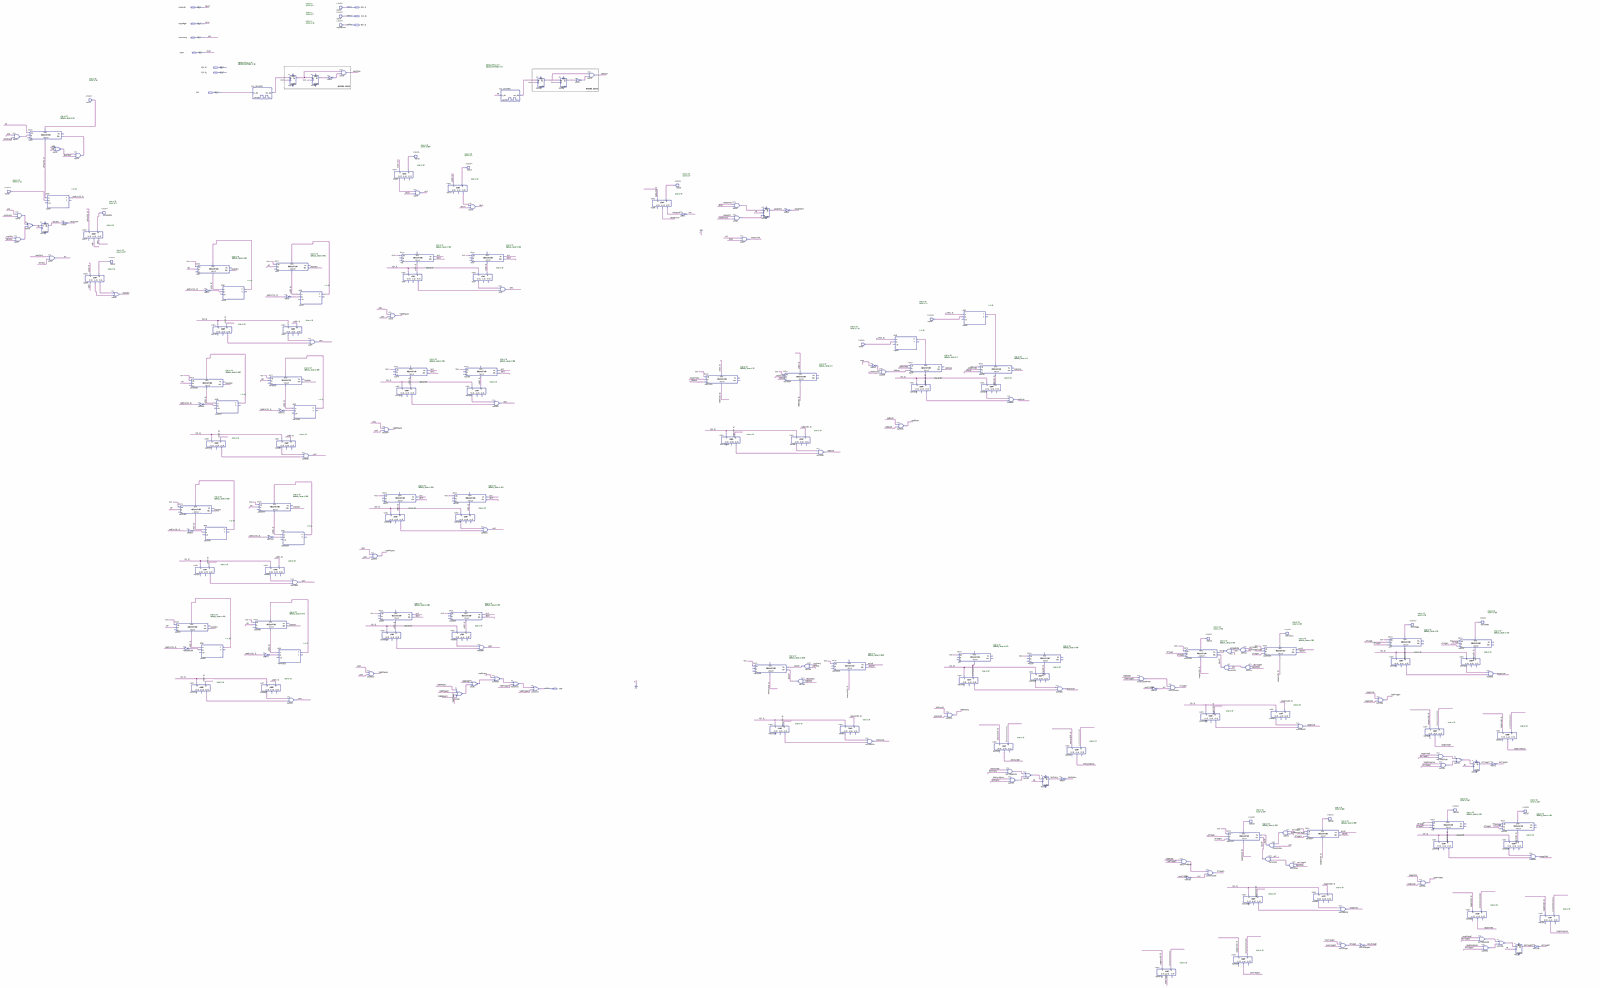
[diagram p0: schematic sheet, whole]
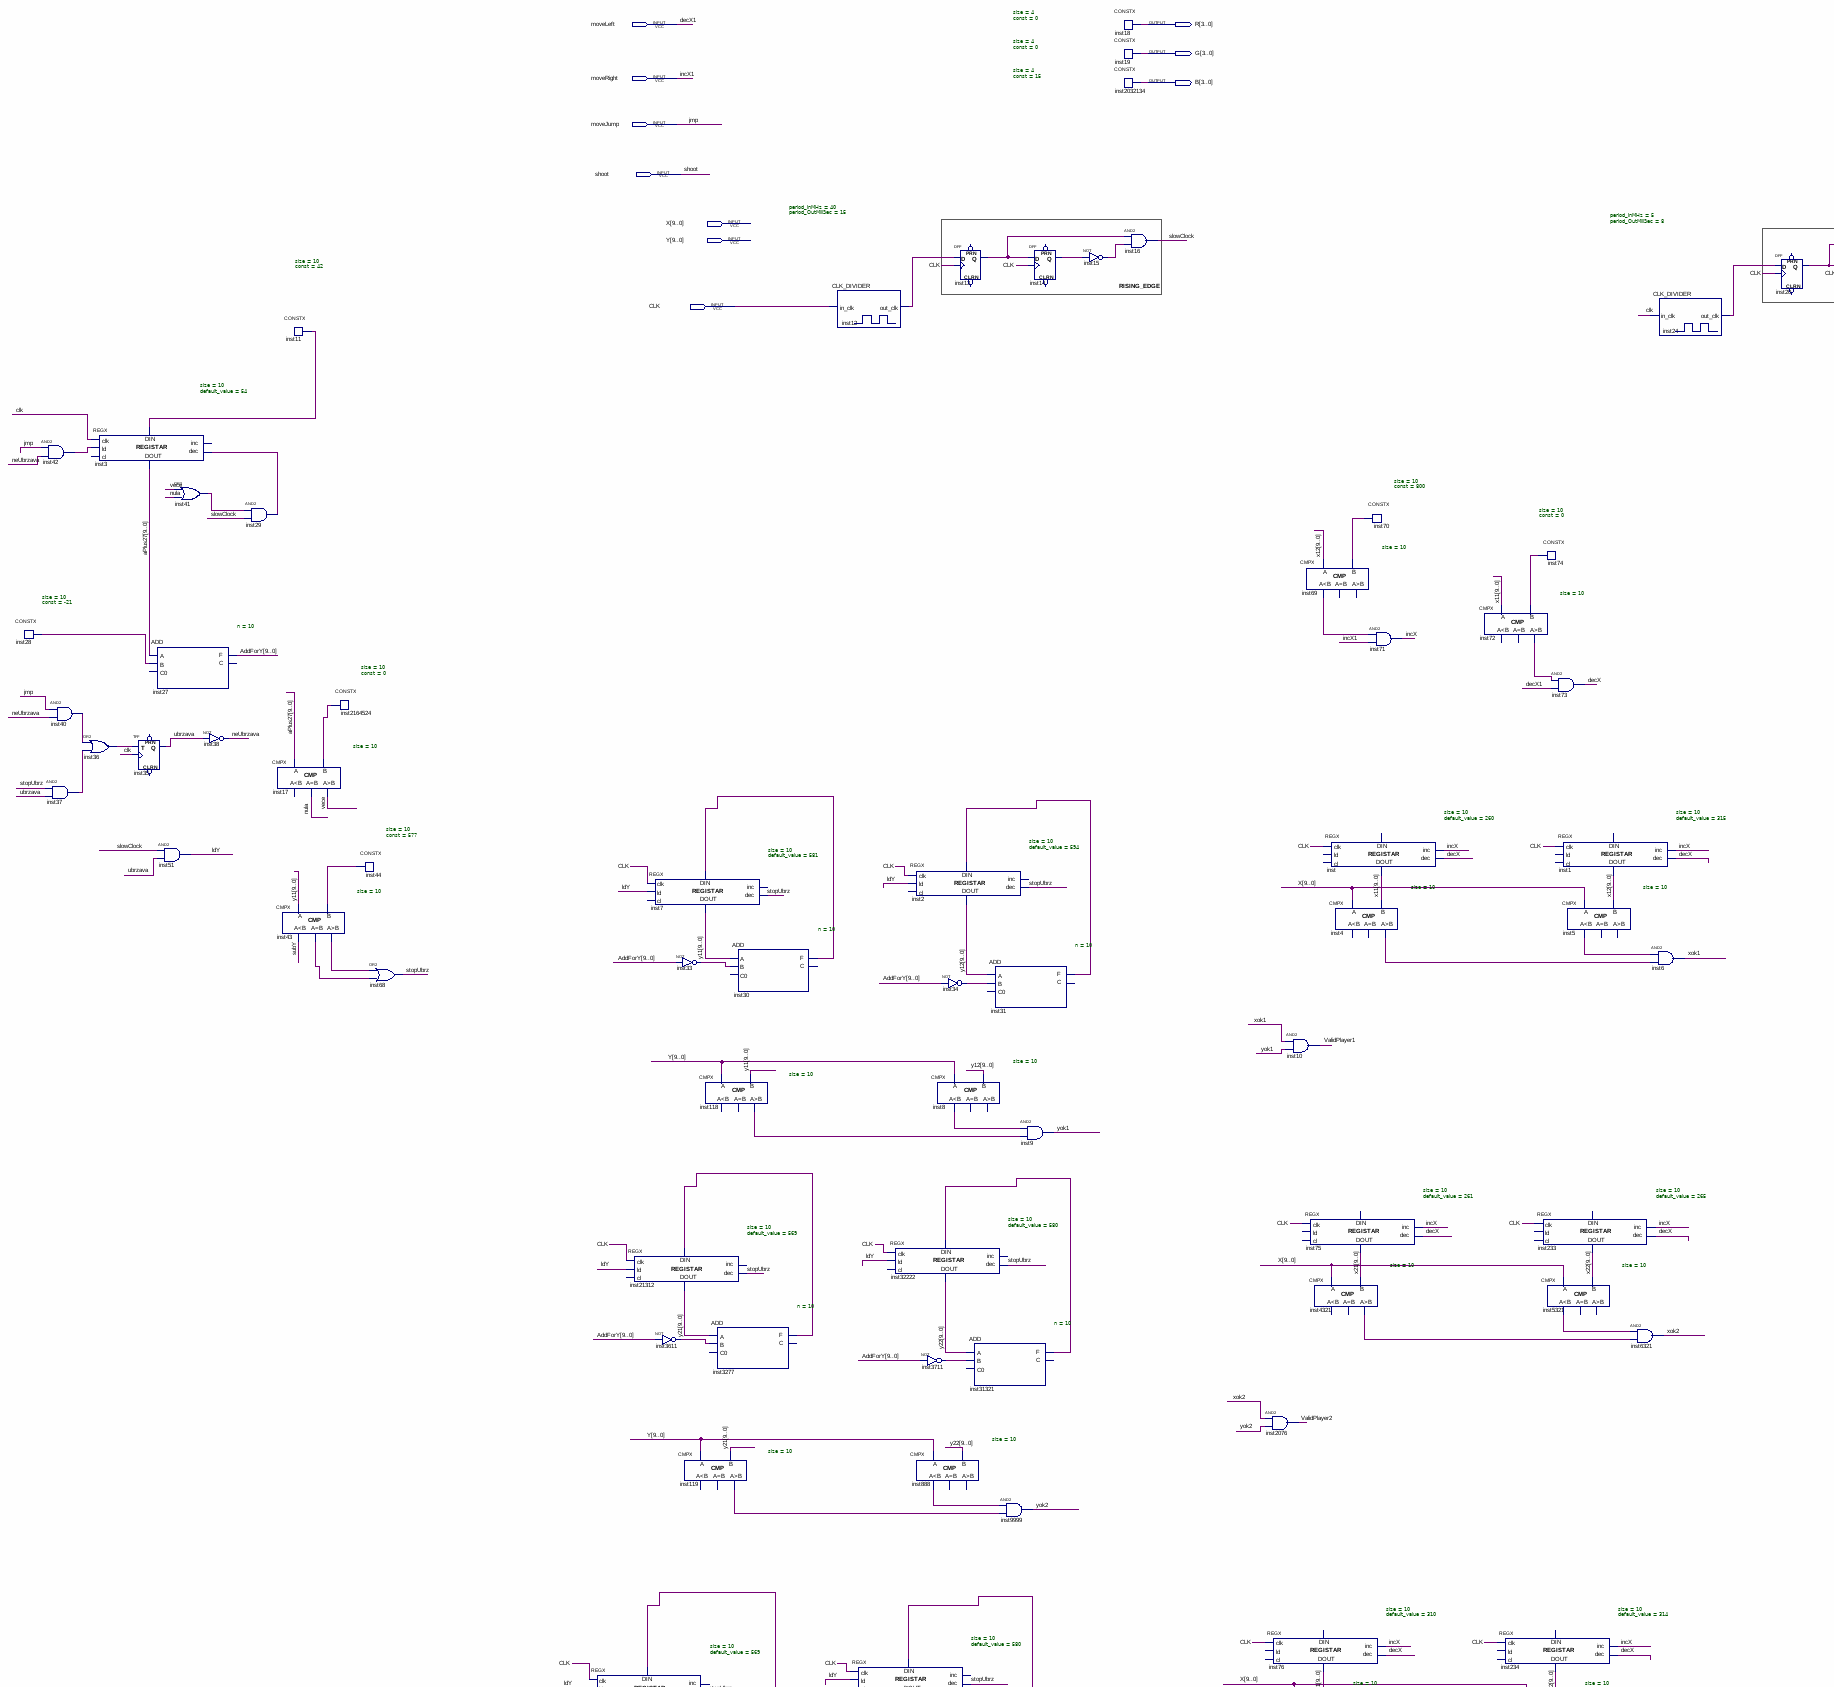
[diagram p1: schematic sheet, upper left part]
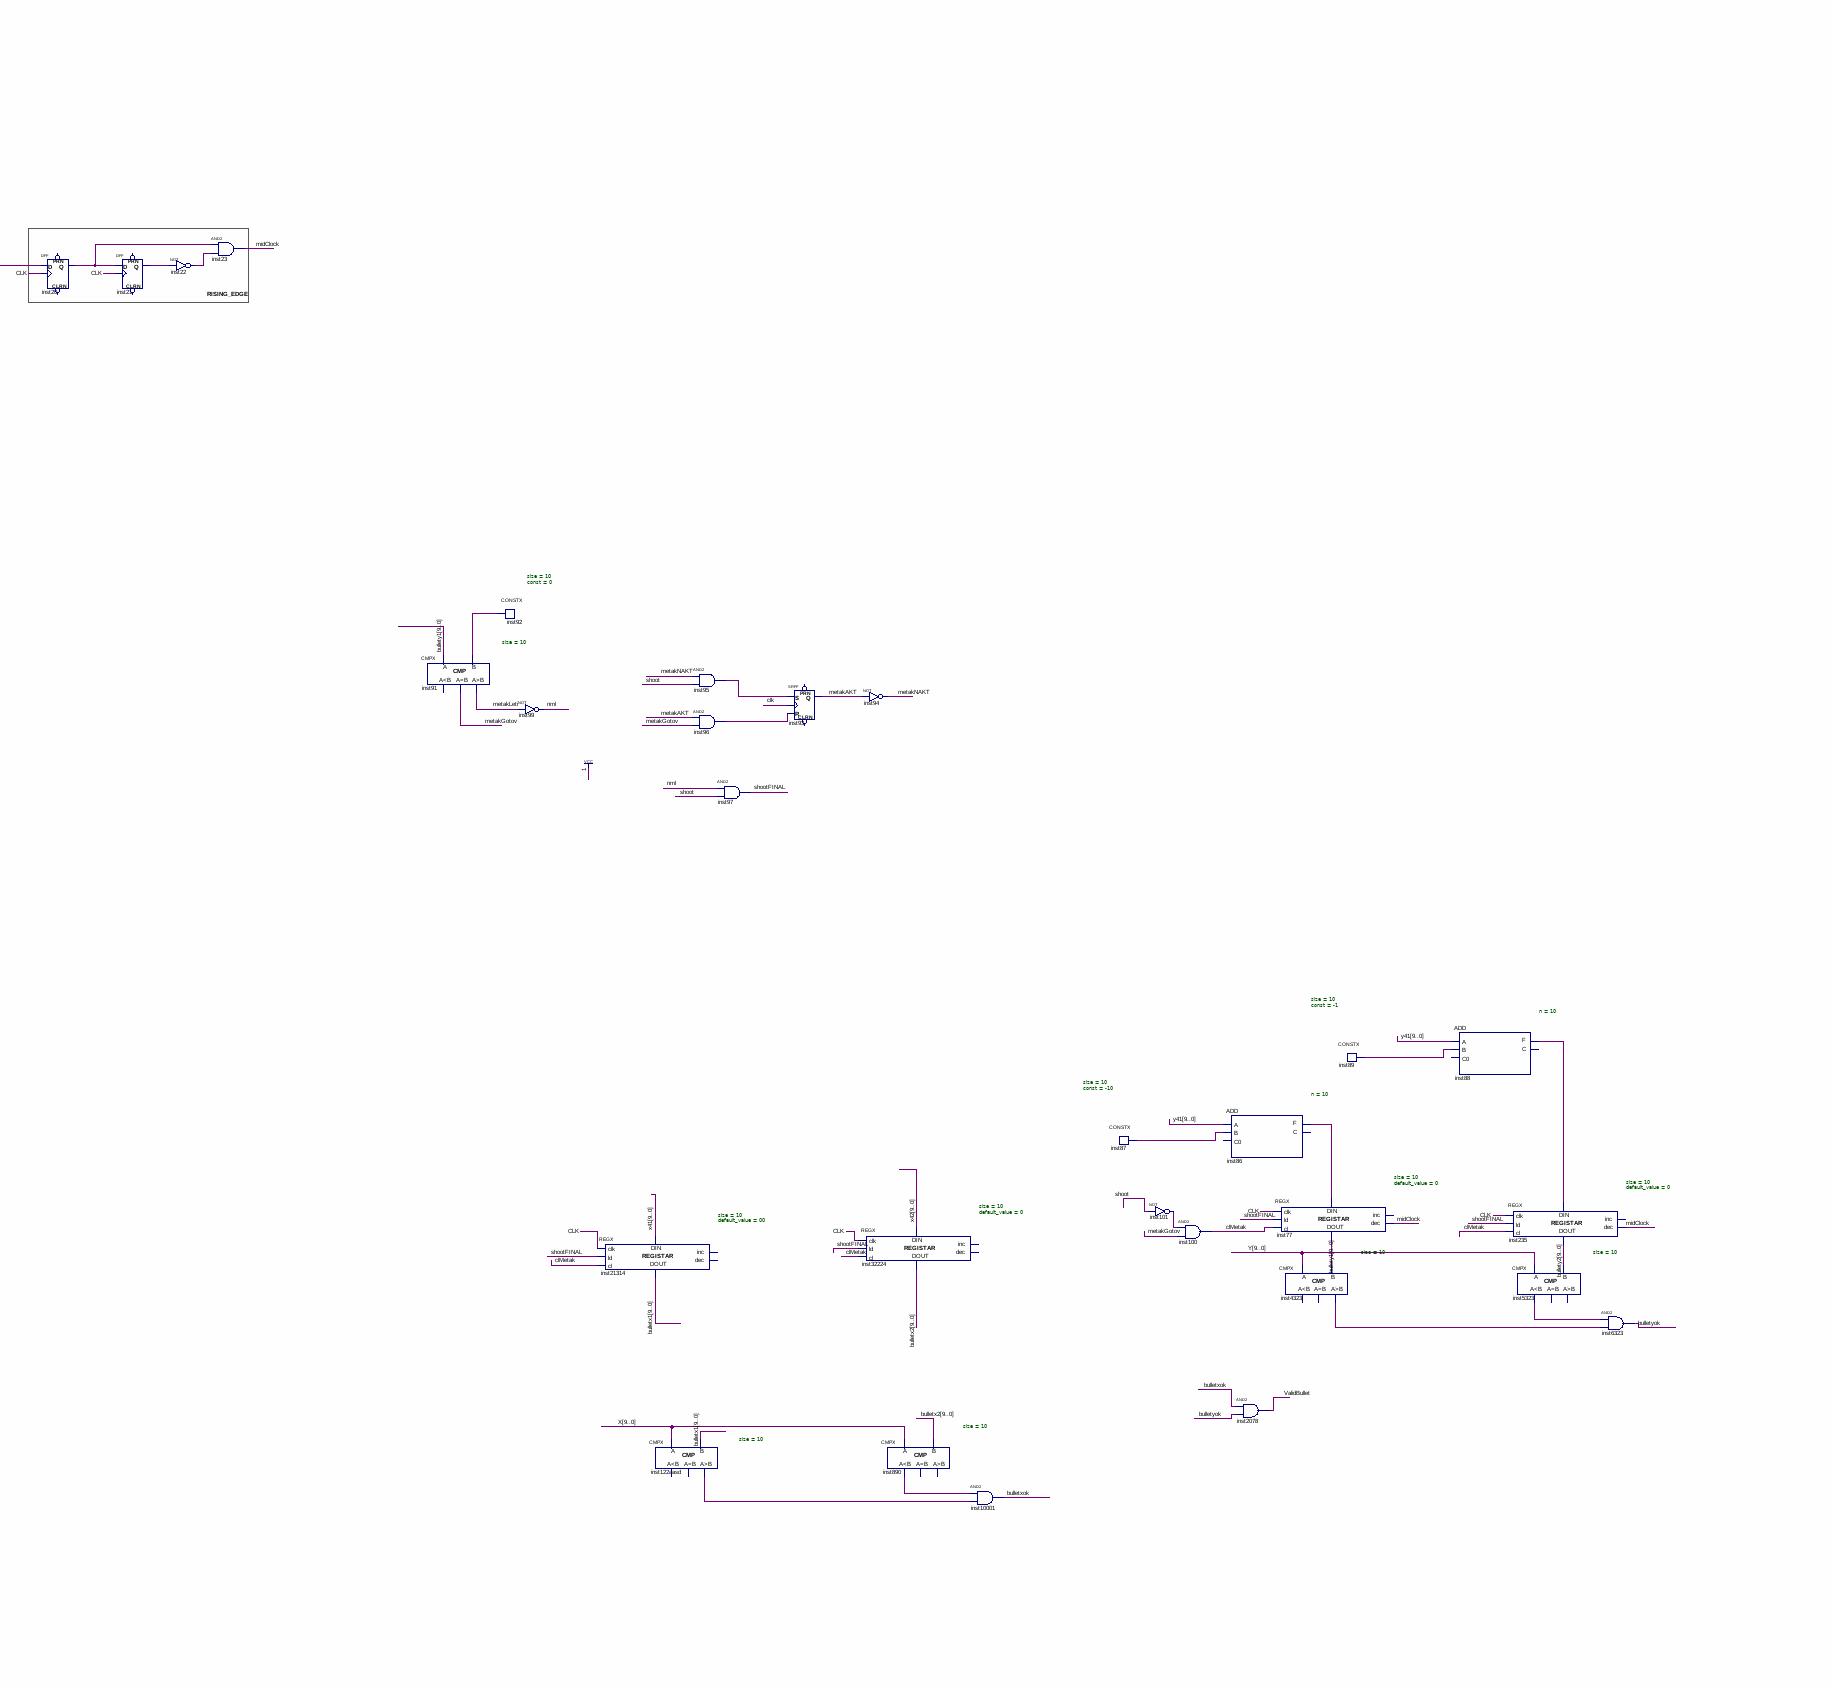
[diagram p2: schematic sheet, upper centre part]
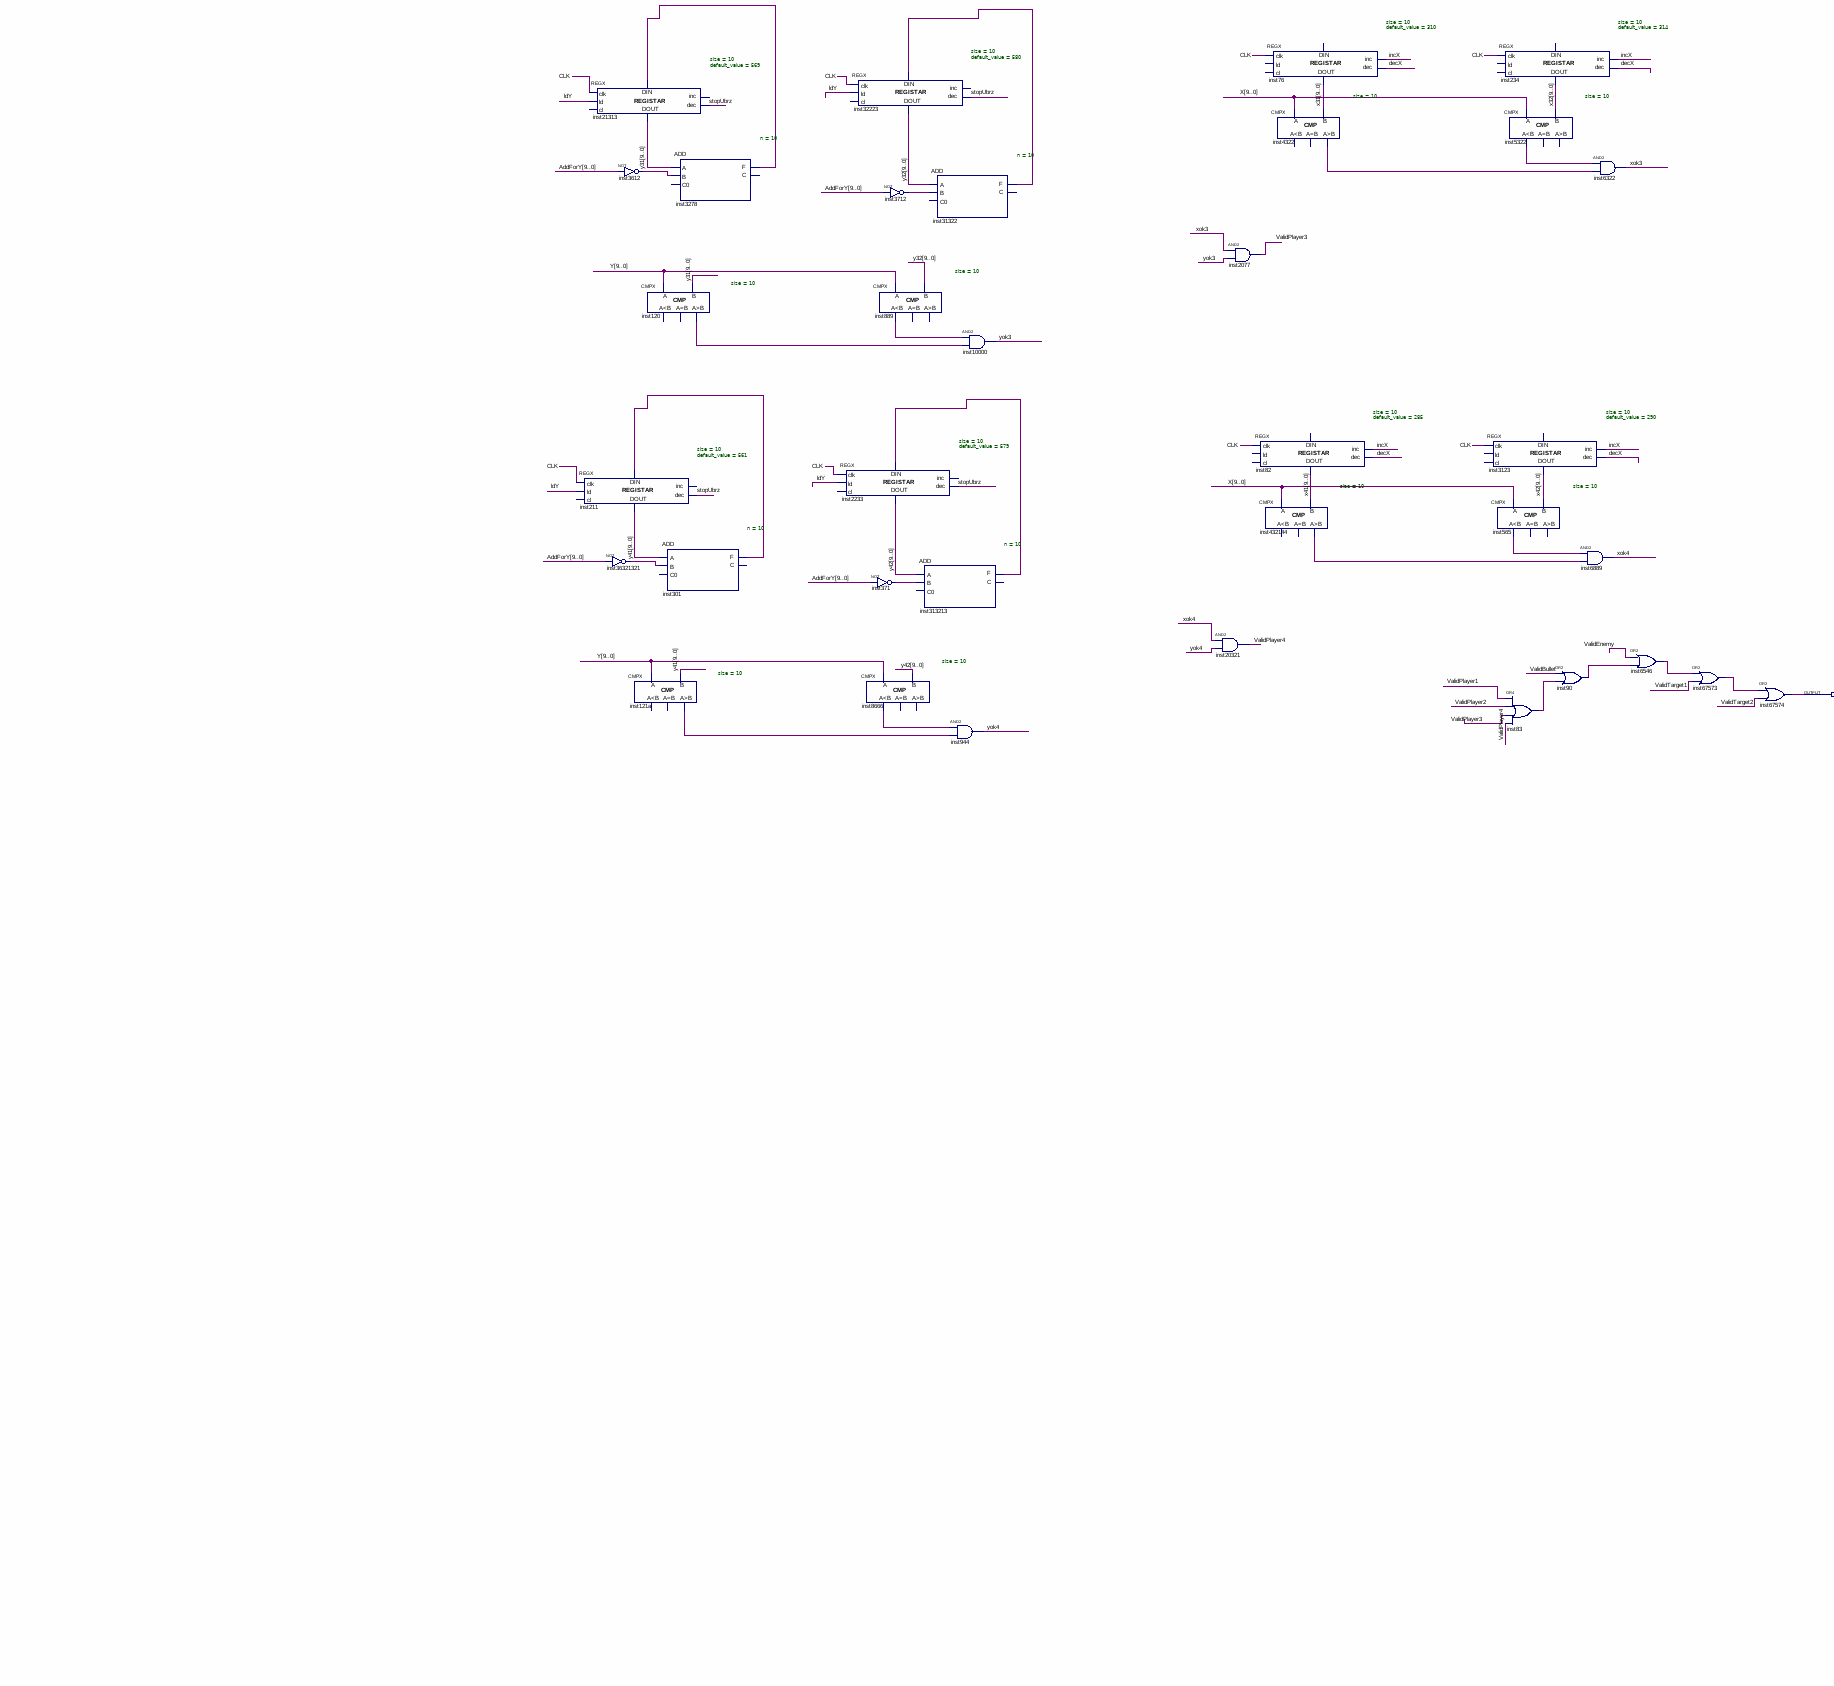
[diagram p3: schematic sheet, lower left part]
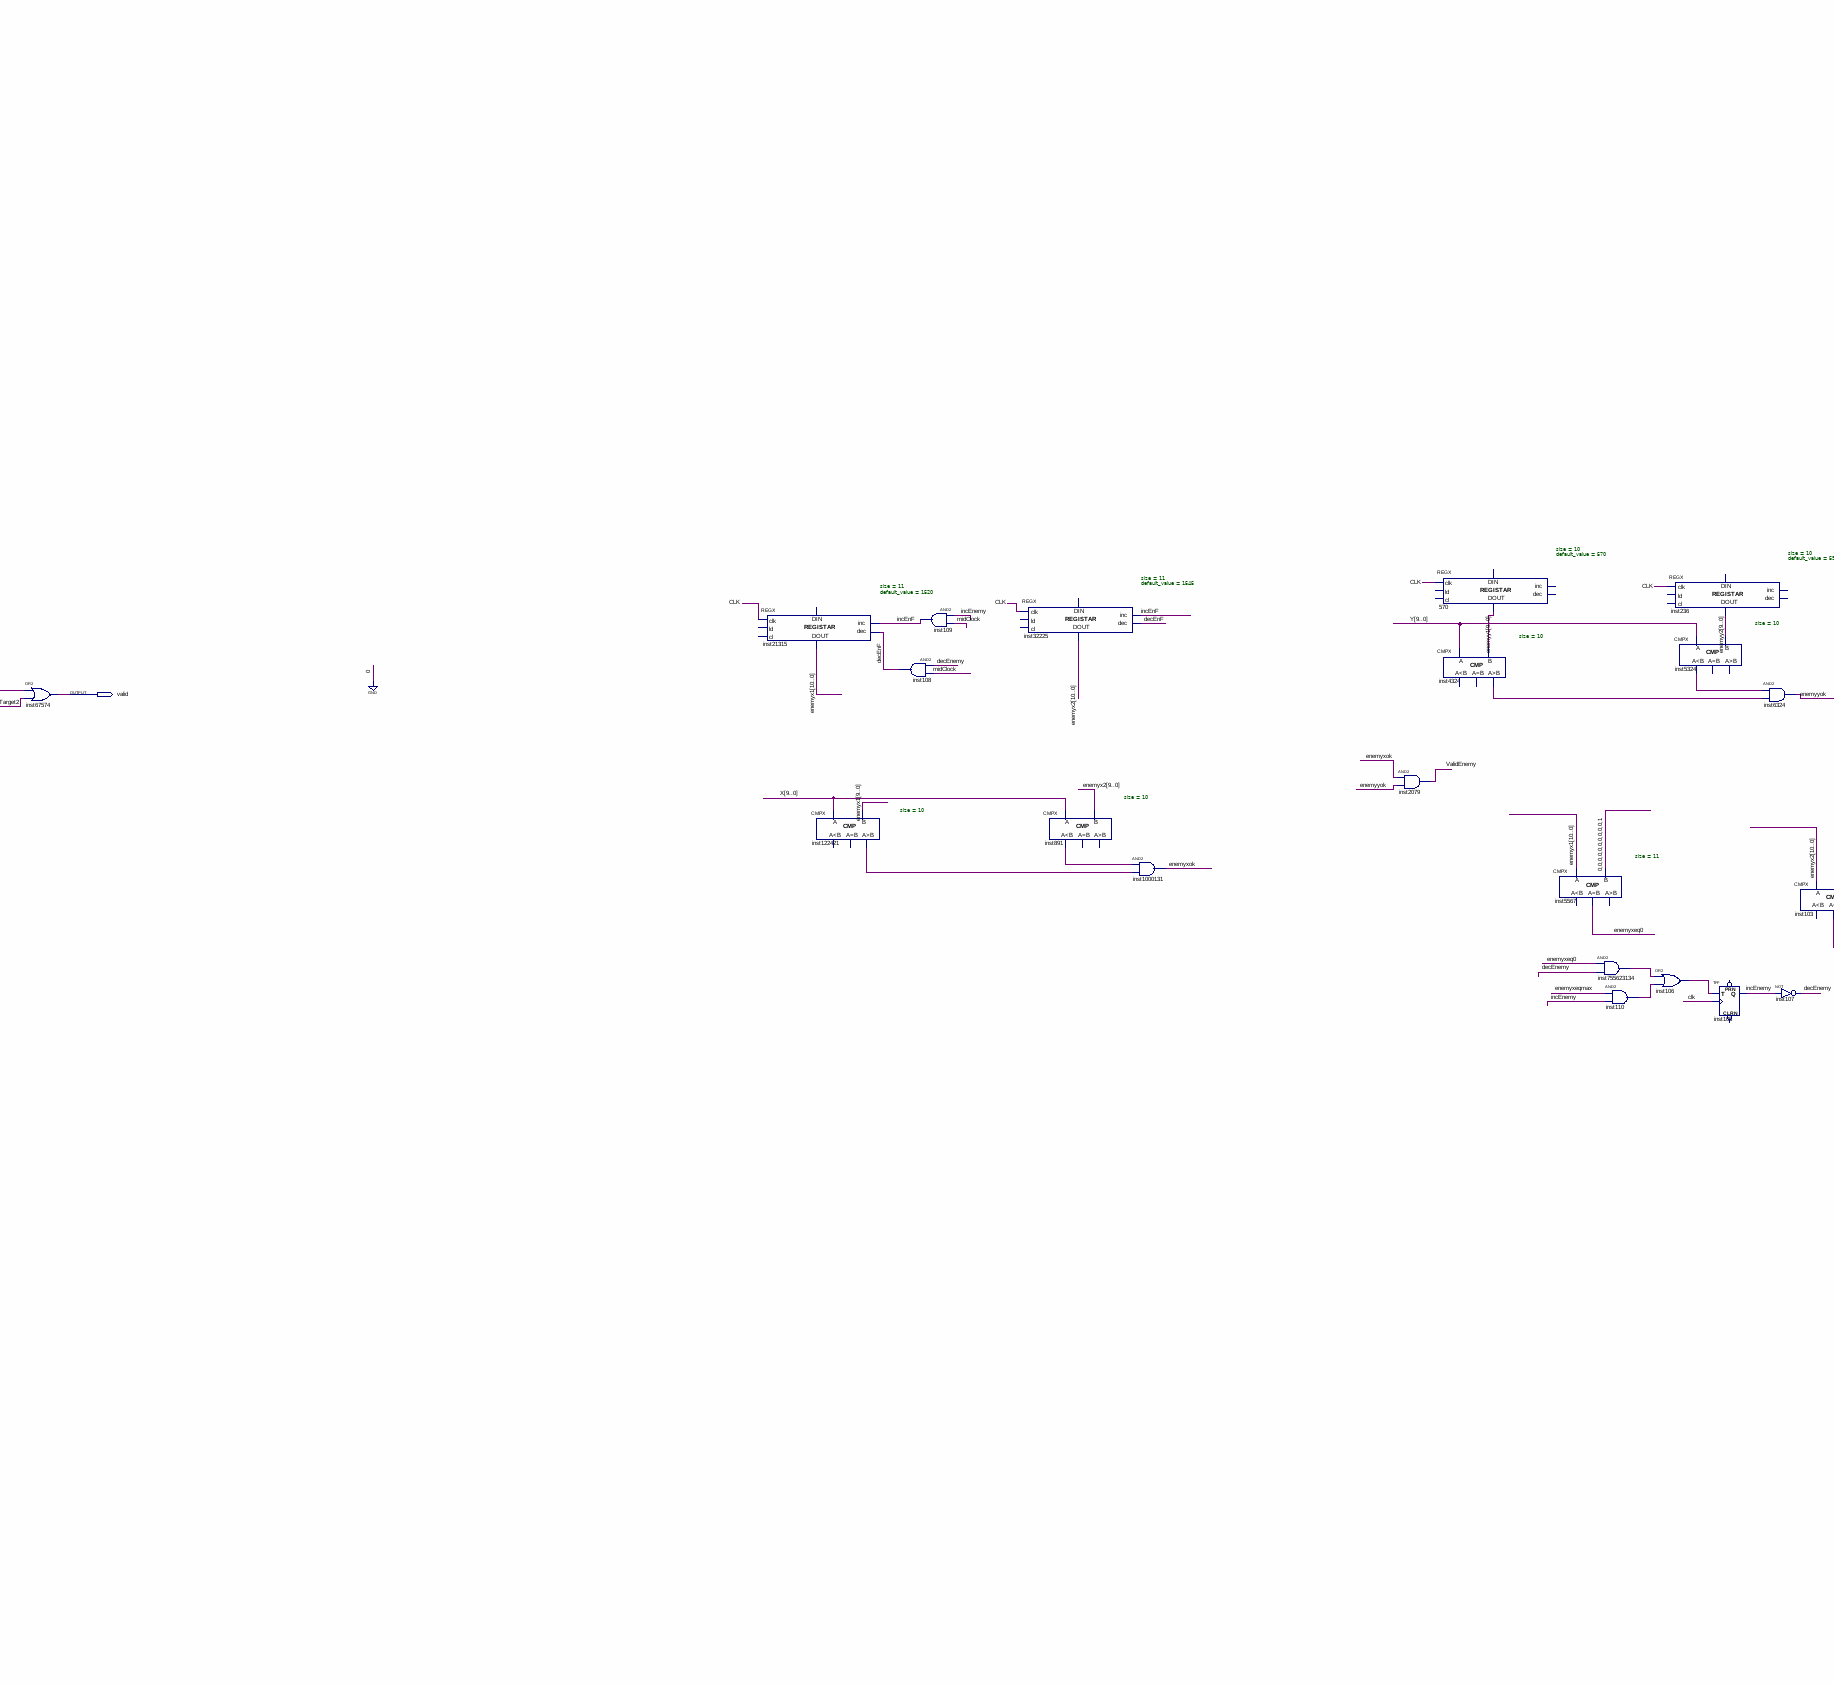
[diagram p4: schematic sheet, lower centre part]
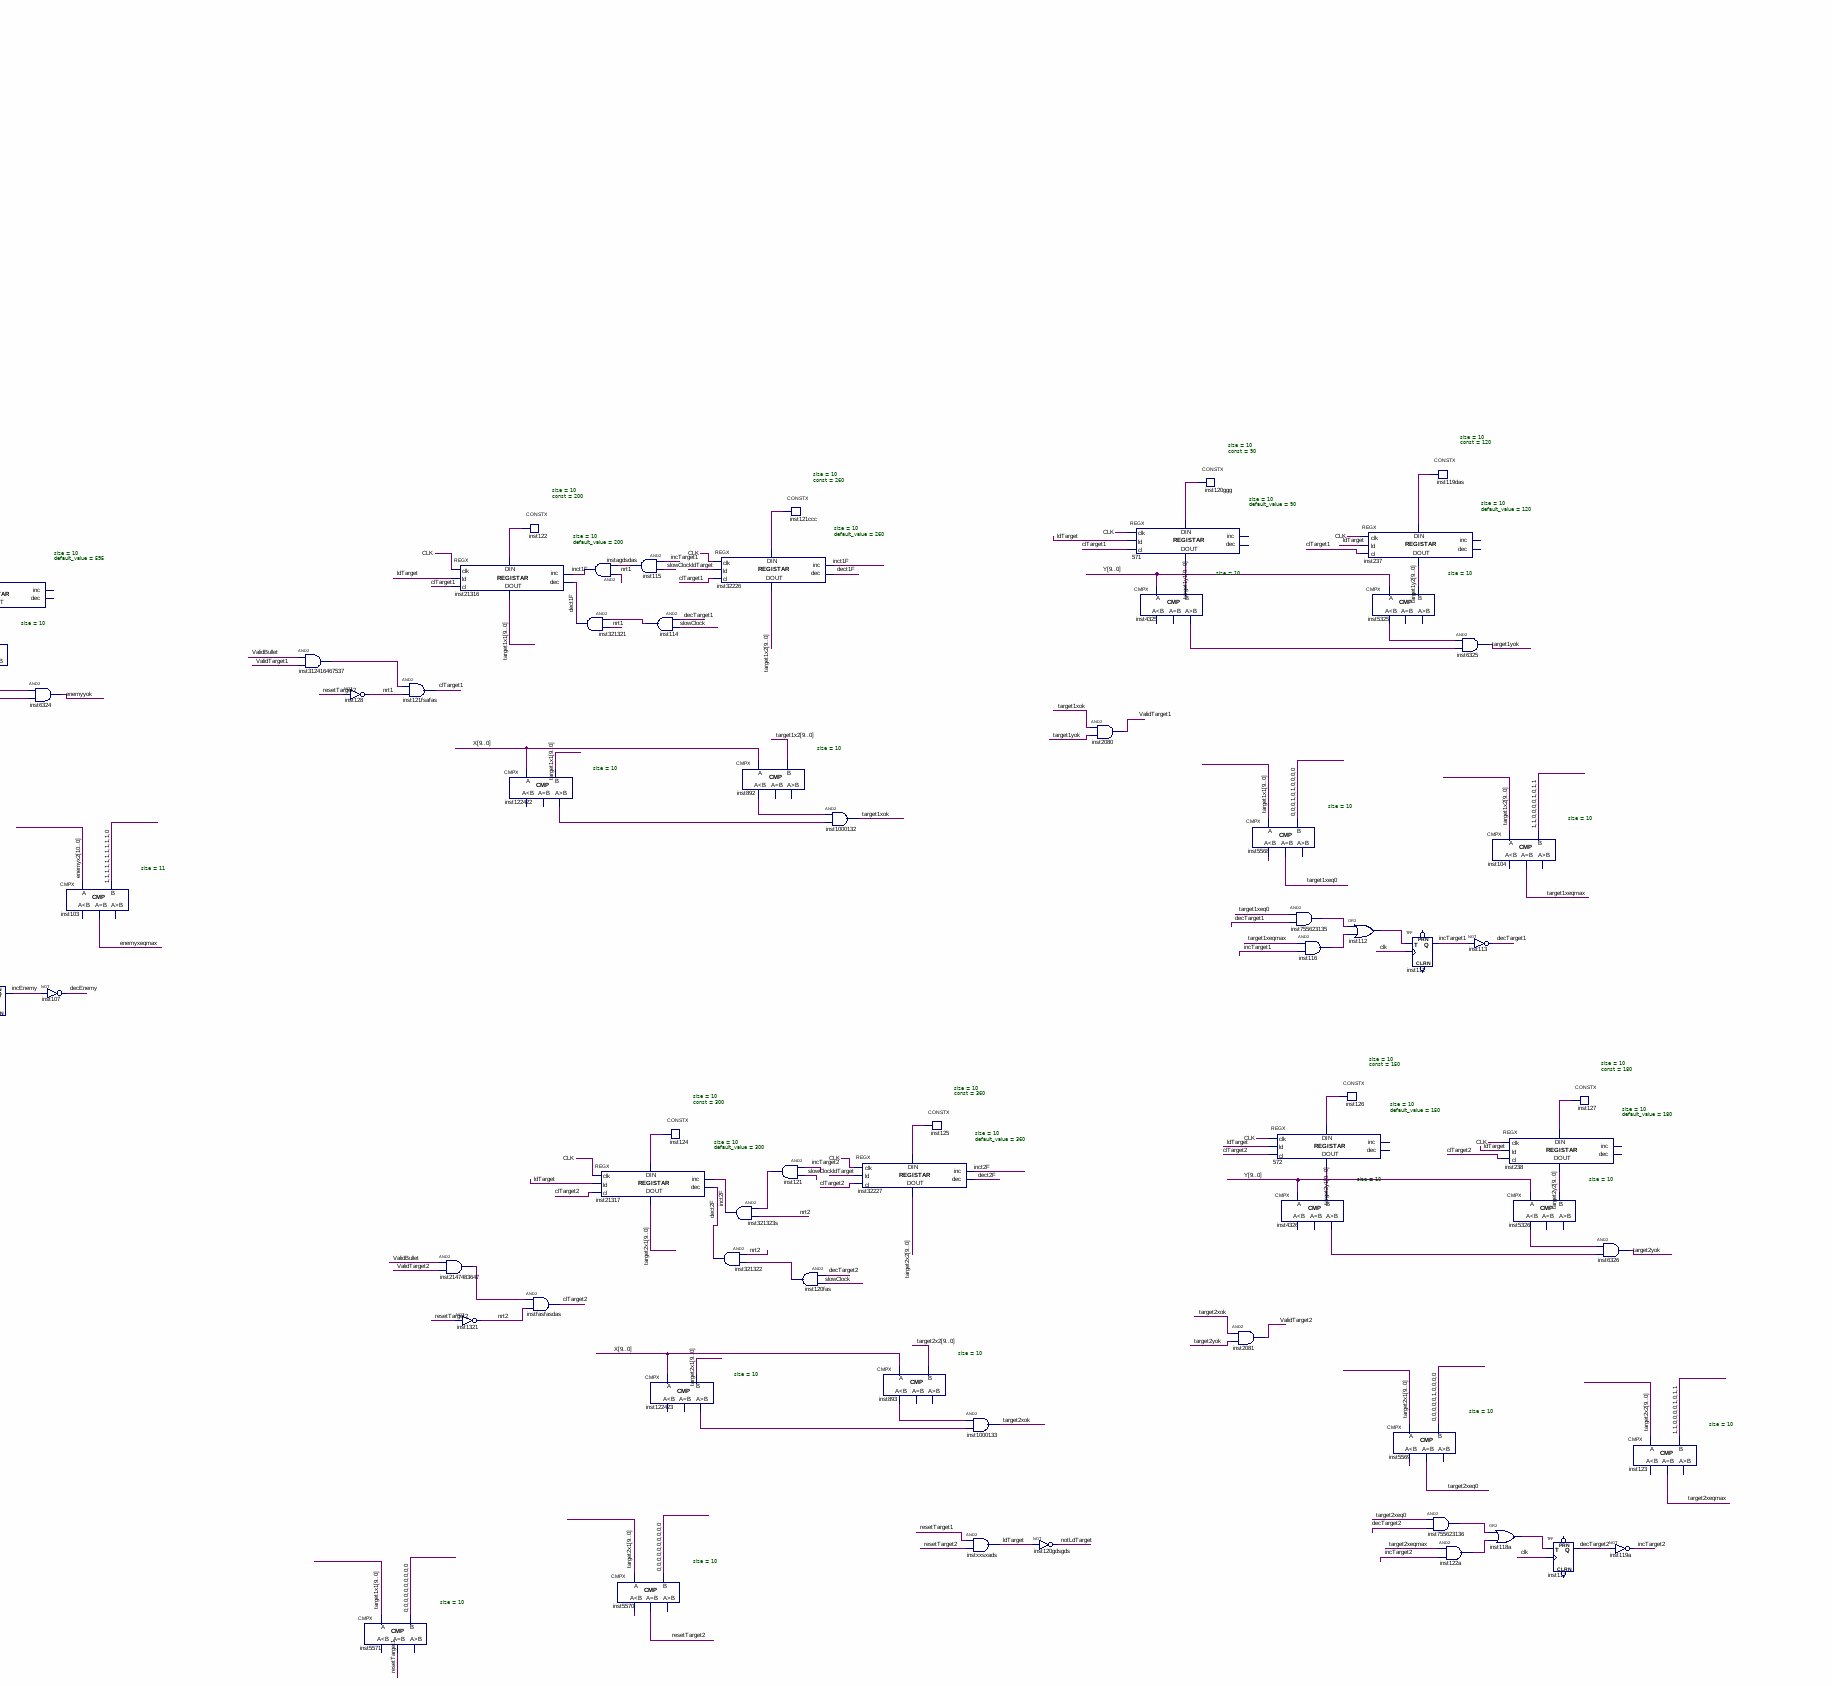
[diagram p5: schematic sheet, lower right part]
// Quartus schematic Layer1.bdf as structural Verilog: 209 symbols, 11 pins
module Layer1 (
  input  moveLeft,
  input  moveRight,
  input  moveJump,
  input  shoot,
  input  [9:0] X,
  input  [9:0] Y,
  input  CLK,
  output [3:0] R,
  output [3:0] G,
  output [3:0] B,
  output valid
);

  wire bulletxok, bulletyok, clMetak, clTarget1, clTarget2, decEnemy, decEnF, dect1F, dect2F, decTarget1,
       decTarget2, decX, enemyxeq0, enemyxeqmax, enemyxok, enemyyok, incEnemy, incEnF, inct1F, inct2F,
       incTarget1, incTarget2, incX, inst4_gr, inst5_ls, inst8_ls, inst12_out_clk, inst13_q, inst14_q,
       inst15_out, inst20_q, inst21_q, inst22_out, inst24_out_clk, inst29_out, inst36_out, inst37_out,
       inst40_out, inst41_out, inst42_out, inst43_eq, inst43_gr, inst69_ls, inst72_gr, inst83_out,
       inst90_out, inst95_out, inst96_out, inst101_out, inst106_out, inst110_out, inst112_out, inst114_out,
       inst115_out, inst116_out, inst118_gr, inst118a_out, inst119_gr, inst120_gr, inst120fas_out,
       inst121_out, inst121a_gr, inst122a_out, inst122aasd_gr, inst565_ls, inst888_ls, inst889_ls,
       inst890_ls, inst891_ls, inst892_ls, inst893_ls, inst4321_gr, inst4322_gr, inst4323_gr, inst4324_gr,
       inst4325_gr, inst4326_gr, inst5321_ls, inst5322_ls, inst5323_ls, inst5324_ls, inst5325_ls,
       inst5326_ls, inst5568_ls, inst5569_ls, inst5570_ls, inst6546_out, inst8666_ls, inst67573_out,
       inst122421_gr, inst122422_gr, inst122423_gr, inst432144_gr, inst755623134_out, inst755623135_out,
       inst755623136_out, inst2147483647_out, inst312416467537_out, ldTarget, ldY, metakAKT, metakGotov,
       metakLeti, metakNAKT, midClock, neUbrzava, nml, notLdTarget, nrt1, nrt2, nula, resetTarget1,
       resetTarget2, shootFINAL, slowClock, stopUbrz, subY, target1xeq0, target1xeqmax, target1xok,
       target1yok, target2xeq0, target2xeqmax, target2xok, target2yok, ubrzava, ValidBullet, ValidEnemy,
       ValidPlayer1, ValidPlayer2, ValidPlayer3, ValidPlayer4, ValidTarget1, ValidTarget2, vece, xok1, xok2,
       xok3, xok4, yok1, yok2, yok3, yok4;
  wire [9:0] AddForY, aPlus27, bulletx1, bulletx2, bullety1, bullety2, enemyy1, enemyy2, inst11_data,
       inst28_data, inst30_f, inst31_f, inst33_out, inst34_out, inst44_data, inst70_data, inst74_data,
       inst86_f, inst87_data, inst88_f, inst89_data, inst92_data, inst119das_data, inst120ggg_data,
       inst121ccc_data, inst122_data, inst124_data, inst125_data, inst126_data, inst127_data, inst301_f,
       inst371_out, inst3277_f, inst3278_f, inst3611_out, inst3612_out, inst3711_out, inst3712_out,
       inst31321_f, inst31322_f, inst313213_f, inst2164524_data, inst36321321_out, target1x1, target1x2,
       target1y1, target1y2, target2x1, target2x2, target2y1, target2y2, x11, x12, x21, x22, x31, x32, x41,
       x42, y11, y12, y21, y22, y31, y32, y41, y42;
  wire [10:0] enemyx1, enemyx2;

  CONSTX #(.size(10), .\const (-21)) inst28 (.data(inst28_data));
  and inst42 (inst42_out, moveJump, neUbrzava);
  and inst40 (inst40_out, moveJump, neUbrzava);
  and inst37 (inst37_out, stopUbrz, ubrzava);
  or inst36 (inst36_out, inst40_out, inst37_out);
  REGX #(.size(10), .default_value(54)) inst3 (
    .clk(CLK), .ld(inst42_out), .dec(inst29_out), .data_in(inst11_data), .data_out(aPlus27));  // open: cl, inc
  ADD #(.n(10)) inst27 (.A(aPlus27), .B(inst28_data), .F(AddForY));  // open: C0, C
  TFF inst35 (.T(inst36_out), .CLK(CLK), .Q(ubrzava));  // open: PRN, CLRN
  or inst41 (inst41_out, vece, nula);
  and inst51 (ldY, slowClock, ubrzava);
  not inst38 (neUbrzava, ubrzava);
  and inst29 (inst29_out, inst41_out, slowClock);
  CONSTX #(.size(10), .\const (42)) inst11 (.data(inst11_data));
  CMPX #(.size(10)) inst17 (.A(aPlus27), .B(inst2164524_data), .eq(nula), .gr(vece));  // open: ls
  CMPX #(.size(10)) inst43 (.A(y11), .B(inst44_data), .ls(subY), .eq(inst43_eq), .gr(inst43_gr));
  CONSTX #(.size(10), .\const (0)) inst2164524 (.data(inst2164524_data));
  CONSTX #(.size(10), .\const (577)) inst44 (.data(inst44_data));
  or inst68 (stopUbrz, inst43_gr, inst43_eq);
  REGX #(.size(10), .default_value(561)) inst211 (
    .clk(CLK), .ld(ldY), .dec(stopUbrz), .data_in(inst301_f), .data_out(y41));  // open: cl, inc
  REGX #(.size(10), .default_value(569)) inst21313 (
    .clk(CLK), .ld(ldY), .dec(stopUbrz), .data_in(inst3278_f), .data_out(y31));  // open: cl, inc
  assign inst36321321_out = ~AddForY;  // NOT inst36321321, 10 bits wide
  REGX #(.size(10), .default_value(581)) inst7 (
    .clk(CLK), .ld(ldY), .dec(stopUbrz), .data_in(inst30_f), .data_out(y11));  // open: cl, inc
  REGX #(.size(10), .default_value(569)) inst21312 (
    .clk(CLK), .ld(ldY), .dec(stopUbrz), .data_in(inst3277_f), .data_out(y21));  // open: cl, inc
  assign inst3612_out = ~AddForY;  // NOT inst3612, 10 bits wide
  CMPX #(.size(10)) inst120 (.A(Y), .B(y31), .gr(inst120_gr));  // open: ls, eq
  CMPX #(.size(10)) inst121a (.A(Y), .B(y41), .gr(inst121a_gr));  // open: ls, eq
  assign inst33_out = ~AddForY;  // NOT inst33, 10 bits wide
  assign inst3611_out = ~AddForY;  // NOT inst3611, 10 bits wide
  CMPX #(.size(10)) inst119 (.A(Y), .B(y21), .gr(inst119_gr));  // open: ls, eq
  ADD #(.n(10)) inst3278 (.A(y31), .B(inst3612_out), .F(inst3278_f));  // open: C0, C
  ADD #(.n(10)) inst301 (.A(y41), .B(inst36321321_out), .F(inst301_f));  // open: C0, C
  CMPX #(.size(10)) inst118 (.A(Y), .B(y11), .gr(inst118_gr));  // open: ls, eq
  ADD #(.n(10)) inst3277 (.A(y21), .B(inst3611_out), .F(inst3277_f));  // open: C0, C
  ADD #(.n(10)) inst30 (.A(y11), .B(inst33_out), .F(inst30_f));  // open: C0, C
  CLK_DIVIDER #(.period_InMHz(40), .period_OutMiliSec(15)) inst12 (.in_clk(CLK), .out_clk(inst12_out_clk));
  REGX #(.size(10), .default_value(579)) inst2233 (
    .clk(CLK), .ld(ldY), .dec(stopUbrz), .data_in(inst313213_f), .data_out(y42));  // open: cl, inc
  REGX #(.size(10), .default_value(580)) inst32223 (
    .clk(CLK), .ld(ldY), .dec(stopUbrz), .data_in(inst31322_f), .data_out(y32));  // open: cl, inc
  CMPX #(.size(10)) inst889 (.A(Y), .B(y32), .ls(inst889_ls));  // open: eq, gr
  assign inst371_out = ~AddForY;  // NOT inst371, 10 bits wide
  CMPX #(.size(10)) inst8666 (.A(Y), .B(y42), .ls(inst8666_ls));  // open: eq, gr
  REGX #(.size(10), .default_value(594)) inst2 (
    .clk(CLK), .ld(ldY), .dec(stopUbrz), .data_in(inst31_f), .data_out(y12));  // open: cl, inc
  REGX #(.size(10), .default_value(580)) inst32222 (
    .clk(CLK), .ld(ldY), .dec(stopUbrz), .data_in(inst31321_f), .data_out(y22));  // open: cl, inc
  CMPX #(.size(10)) inst888 (.A(Y), .B(y22), .ls(inst888_ls));  // open: eq, gr
  assign inst3712_out = ~AddForY;  // NOT inst3712, 10 bits wide
  assign inst34_out = ~AddForY;  // NOT inst34, 10 bits wide
  CMPX #(.size(10)) inst8 (.A(Y), .B(y12), .ls(inst8_ls));  // open: eq, gr
  assign inst3711_out = ~AddForY;  // NOT inst3711, 10 bits wide
  ADD #(.n(10)) inst31322 (.A(y32), .B(inst3712_out), .F(inst31322_f));  // open: C0, C
  ADD #(.n(10)) inst313213 (.A(y42), .B(inst371_out), .F(inst313213_f));  // open: C0, C
  DFF inst13 (.CLK(CLK), .D(inst12_out_clk), .Q(inst13_q));  // open: CLRN, PRN
  ADD #(.n(10)) inst31321 (.A(y22), .B(inst3711_out), .F(inst31321_f));  // open: C0, C
  and inst10000 (yok3, inst889_ls, inst120_gr);
  and inst944 (yok4, inst8666_ls, inst121a_gr);
  ADD #(.n(10)) inst31 (.A(y12), .B(inst34_out), .F(inst31_f));  // open: C0, C
  and inst9999 (yok2, inst888_ls, inst119_gr);
  DFF inst14 (.CLK(CLK), .D(inst13_q), .Q(inst14_q));  // open: CLRN, PRN
  and inst9 (yok1, inst8_ls, inst118_gr);
  CONSTX #(.size(4), .\const (0)) inst18 (.data(R));
  CONSTX #(.size(4), .\const (0)) inst19 (.data(G));
  CONSTX #(.size(4), .\const (15)) inst2032134 (.data(B));
  not inst15 (inst15_out, inst14_q);
  and inst16 (slowClock, inst13_q, inst15_out);
  and inst2077 (ValidPlayer3, xok3, yok3);
  and inst20321 (ValidPlayer4, xok4, yok4);
  and inst2076 (ValidPlayer2, xok2, yok2);
  REGX #(.size(10), .default_value(310)) inst76 (
    .clk(CLK), .inc(incX), .dec(decX), .data_out(x31));  // open: ld, cl, data_in
  CMPX #(.size(10)) inst4322 (.A(X), .B(x31), .gr(inst4322_gr));  // open: ls, eq
  REGX #(.size(10), .default_value(285)) inst82 (
    .clk(CLK), .inc(incX), .dec(decX), .data_out(x41));  // open: ld, cl, data_in
  CMPX #(.size(10)) inst432144 (.A(X), .B(x41), .gr(inst432144_gr));  // open: ls, eq
  CMPX #(.size(10)) inst69 (.A(x12), .B(inst70_data), .ls(inst69_ls));  // open: eq, gr
  and inst10 (ValidPlayer1, xok1, yok1);
  REGX #(.size(10), .default_value(261)) inst75 (
    .clk(CLK), .inc(incX), .dec(decX), .data_out(x21));  // open: ld, cl, data_in
  CMPX #(.size(10)) inst4321 (.A(X), .B(x21), .gr(inst4321_gr));  // open: ls, eq
  REGX #(.size(10), .default_value(260)) inst (
    .clk(CLK), .inc(incX), .dec(decX), .data_out(x11));  // open: ld, cl, data_in
  CMPX #(.size(10)) inst4 (.A(X), .B(x11), .gr(inst4_gr));  // open: ls, eq
  CONSTX #(.size(10), .\const (800)) inst70 (.data(inst70_data));
  and inst71 (incX, inst69_ls, moveRight);
  CMPX #(.size(10)) inst72 (.A(x11), .B(inst74_data), .gr(inst72_gr));  // open: ls, eq
  REGX #(.size(10), .default_value(314)) inst234 (
    .clk(CLK), .inc(incX), .dec(decX), .data_out(x32));  // open: ld, cl, data_in
  CMPX #(.size(10)) inst5322 (.A(X), .B(x32), .ls(inst5322_ls));  // open: eq, gr
  REGX #(.size(10), .default_value(290)) inst3123 (
    .clk(CLK), .inc(incX), .dec(decX), .data_out(x42));  // open: ld, cl, data_in
  CMPX #(.size(10)) inst565 (.A(X), .B(x42), .ls(inst565_ls));  // open: eq, gr
  or inst83 (inst83_out, ValidPlayer1, ValidPlayer2, ValidPlayer3, ValidPlayer4);
  CONSTX #(.size(10), .\const (0)) inst74 (.data(inst74_data));
  REGX #(.size(10), .default_value(265)) inst233 (
    .clk(CLK), .inc(incX), .dec(decX), .data_out(x22));  // open: ld, cl, data_in
  CMPX #(.size(10)) inst5321 (.A(X), .B(x22), .ls(inst5321_ls));  // open: eq, gr
  and inst73 (decX, inst72_gr, moveLeft);
  REGX #(.size(10), .default_value(315)) inst1 (
    .clk(CLK), .inc(incX), .dec(decX), .data_out(x12));  // open: ld, cl, data_in
  CMPX #(.size(10)) inst5 (.A(X), .B(x12), .ls(inst5_ls));  // open: eq, gr
  or inst90 (inst90_out, ValidBullet, inst83_out);
  and inst6322 (xok3, inst5322_ls, inst4322_gr);
  and inst6889 (xok4, inst565_ls, inst432144_gr);
  and inst6321 (xok2, inst5321_ls, inst4321_gr);
  or inst6546 (inst6546_out, ValidEnemy, inst90_out);
  CLK_DIVIDER #(.period_InMHz(5), .period_OutMiliSec(8)) inst24 (.in_clk(CLK), .out_clk(inst24_out_clk));
  and inst6 (xok1, inst5_ls, inst4_gr);
  or inst67573 (inst67573_out, inst6546_out, ValidTarget1);
  DFF inst20 (.CLK(CLK), .D(inst24_out_clk), .Q(inst20_q));  // open: CLRN, PRN
  or inst67574 (valid, inst67573_out, ValidTarget2);
  DFF inst21 (.CLK(CLK), .D(inst20_q), .Q(inst21_q));  // open: CLRN, PRN
  not inst22 (inst22_out, inst21_q);
  and inst23 (midClock, inst20_q, inst22_out);
  CMPX #(.size(10)) inst91 (.A(bullety1), .B(inst92_data), .eq(metakGotov), .gr(metakLeti));  // open: ls
  CONSTX #(.size(10), .\const (0)) inst92 (.data(inst92_data));
  not inst99 (nml, metakLeti);
  REGX #(.size(10), .default_value(00)) inst21314 (
    .clk(CLK), .ld(shootFINAL), .cl(clMetak), .data_in(x41), .data_out(bulletx1));  // open: inc, dec
  CMPX #(.size(10)) inst122aasd (.A(X), .B(bulletx1), .gr(inst122aasd_gr));  // open: ls, eq
  and inst95 (inst95_out, metakNAKT, shoot);
  and inst96 (inst96_out, metakAKT, metakGotov);
  and inst97 (shootFINAL, nml, shoot);
  REGX #(.size(11), .default_value(1520)) inst21315 (
    .clk(CLK), .inc(incEnF), .dec(decEnF), .data_out(enemyx1));  // open: ld, cl, data_in
  SRFF inst93 (.S(inst95_out), .R(inst96_out), .CLK(CLK), .Q(metakAKT));  // open: PRN, CLRN
  CMPX #(.size(10)) inst122421 (.A(X), .B(enemyx1[9:0]), .gr(inst122421_gr));  // open: ls, eq
  not inst94 (metakNAKT, metakAKT);
  REGX #(.size(10), .default_value(0)) inst32224 (
    .clk(CLK), .ld(shootFINAL), .cl(clMetak), .data_in(x42), .data_out(bulletx2));  // open: inc, dec
  CMPX #(.size(10)) inst890 (.A(X), .B(bulletx2), .ls(inst890_ls));  // open: eq, gr
  and inst108 (decEnF, decEnemy, midClock);
  and inst109 (incEnF, incEnemy, midClock);
  and inst10001 (bulletxok, inst890_ls, inst122aasd_gr);
  REGX #(.size(11), .default_value(1545)) inst32225 (
    .clk(CLK), .inc(incEnF), .dec(decEnF), .data_out(enemyx2));  // open: ld, cl, data_in
  CMPX #(.size(10)) inst891 (.A(X), .B(enemyx2[9:0]), .ls(inst891_ls));  // open: eq, gr
  CONSTX #(.size(10), .\const (-10)) inst87 (.data(inst87_data));
  and inst1000131 (enemyxok, inst891_ls, inst122421_gr);
  not inst101 (inst101_out, shoot);
  and inst100 (clMetak, inst101_out, metakGotov);
  ADD #(.n(10)) inst86 (.A(y41), .B(inst87_data), .F(inst86_f));  // open: C0, C
  and inst2078 (ValidBullet, bulletxok, bulletyok);
  REGX #(.size(10), .default_value(0)) inst77 (
    .clk(CLK), .ld(shootFINAL), .cl(clMetak), .dec(midClock), .data_in(inst86_f), .data_out(bullety1));  // open: inc
  CMPX #(.size(10)) inst4323 (.A(Y), .B(bullety1), .gr(inst4323_gr));  // open: ls, eq
  CONSTX #(.size(10), .\const (-1)) inst89 (.data(inst89_data));
  and inst2079 (ValidEnemy, enemyxok, enemyyok);
  REGX #(.size(10), .default_value(570)) u_570 (.clk(CLK), .data_out(enemyy1));  // open: ld, cl, inc, dec, data_in
  CMPX #(.size(10)) inst4324 (.A(Y), .B(enemyy1), .gr(inst4324_gr));  // open: ls, eq
  ADD #(.n(10)) inst88 (.A(y41), .B(inst89_data), .F(inst88_f));  // open: C0, C
  REGX #(.size(10), .default_value(0)) inst235 (
    .clk(CLK), .ld(shootFINAL), .cl(clMetak), .dec(midClock), .data_in(inst88_f), .data_out(bullety2));  // open: inc
  CMPX #(.size(10)) inst5323 (.A(Y), .B(bullety2), .ls(inst5323_ls));  // open: eq, gr
  CMPX #(.size(11)) inst5567 (.A(enemyx1), .B(11'b00000000001), .eq(enemyxeq0));  // open: ls, gr
  and inst6323 (bulletyok, inst5323_ls, inst4323_gr);
  and inst755623134 (inst755623134_out, enemyxeq0, decEnemy);
  and inst110 (inst110_out, enemyxeqmax, incEnemy);
  REGX #(.size(10), .default_value(595)) inst236 (.clk(CLK), .data_out(enemyy2));  // open: ld, cl, inc, dec, data_in
  or inst106 (inst106_out, inst755623134_out, inst110_out);
  CMPX #(.size(10)) inst5324 (.A(Y), .B(enemyy2), .ls(inst5324_ls));  // open: eq, gr
  TFF inst105 (.T(inst106_out), .CLK(CLK), .Q(incEnemy));  // open: PRN, CLRN
  and inst6324 (enemyyok, inst5324_ls, inst4324_gr);
  CMPX #(.size(11)) inst103 (.A(enemyx2), .B(11'b11111111110), .eq(enemyxeqmax));  // open: ls, gr
  not inst107 (decEnemy, incEnemy);
  and inst312416467537 (inst312416467537_out, ValidBullet, ValidTarget1);
  not inst128 (nrt1, resetTarget2);
  CMPX #(.size(10)) inst5571 (.A(target1x1), .B({10{1'b0}}), .eq(resetTarget1));  // open: ls, gr
  and inst121fsafas (clTarget1, inst312416467537_out, nrt1);
  REGX #(.size(10), .default_value(200)) inst21316 (
    .clk(CLK), .ld(ldTarget), .cl(clTarget1), .inc(inct1F), .dec(dect1F), .data_in(inst122_data),
    .data_out(target1x1));
  and inst2147483647 (inst2147483647_out, ValidBullet, ValidTarget2);
  not inst1321 (nrt2, resetTarget2);
  CONSTX #(.size(10), .\const (200)) inst122 (.data(inst122_data));
  CMPX #(.size(10)) inst122422 (.A(X), .B(target1x1), .gr(inst122422_gr));  // open: ls, eq
  and instfasfasdas (clTarget2, inst2147483647_out, nrt2);
  and instagdsdas (inct1F, nrt1, inst115_out);
  and inst321321 (dect1F, inst114_out, nrt1);
  REGX #(.size(10), .default_value(300)) inst21317 (
    .clk(CLK), .ld(ldTarget), .cl(clTarget2), .inc(inct2F), .dec(dect2F), .data_in(inst124_data),
    .data_out(target2x1));
  and inst115 (inst115_out, incTarget1, slowClock);
  CMPX #(.size(10)) inst5570 (.A(target2x1), .B({10{1'b0}}), .ls(inst5570_ls), .eq(resetTarget2));  // open: gr
  and inst114 (inst114_out, decTarget1, slowClock);
  CONSTX #(.size(10), .\const (300)) inst124 (.data(inst124_data));
  CMPX #(.size(10)) inst122423 (.A(X), .B(target2x1), .gr(inst122423_gr));  // open: ls, eq
  REGX #(.size(10), .default_value(260)) inst32226 (
    .clk(CLK), .ld(ldTarget), .cl(clTarget1), .inc(inct1F), .dec(dect1F), .data_in(inst121ccc_data),
    .data_out(target1x2));
  and inst321323s (inct2F, inst121_out, nrt2);
  and inst321322 (dect2F, nrt2, inst120fas_out);
  CMPX #(.size(10)) inst892 (.A(X), .B(target1x2), .ls(inst892_ls));  // open: eq, gr
  CONSTX #(.size(10), .\const (260)) inst121ccc (.data(inst121ccc_data));
  and inst121 (inst121_out, incTarget2, slowClock);
  and inst120fas (inst120fas_out, decTarget2, slowClock);
  and inst1000132 (target1xok, inst892_ls, inst122422_gr);
  REGX #(.size(10), .default_value(360)) inst32227 (
    .clk(CLK), .ld(ldTarget), .cl(clTarget2), .inc(inct2F), .dec(dect2F), .data_in(inst125_data),
    .data_out(target2x2));
  CMPX #(.size(10)) inst893 (.A(X), .B(target2x2), .ls(inst893_ls));  // open: eq, gr
  CONSTX #(.size(10), .\const (360)) inst125 (.data(inst125_data));
  and inst1000133 (target2xok, inst893_ls, inst122423_gr);
  and instxxsxads (ldTarget, resetTarget1, resetTarget2);
  not inst120gdsgds (notLdTarget, ldTarget);
  and inst2080 (ValidTarget1, target1xok, target1yok);
  REGX #(.size(10), .default_value(90)) u_571 (
    .clk(CLK), .ld(ldTarget), .cl(clTarget1), .data_in(inst120ggg_data), .data_out(target1y1));  // open: inc, dec
  CMPX #(.size(10)) inst4325 (.A(Y), .B(target1y1), .gr(inst4325_gr));  // open: ls, eq
  CONSTX #(.size(10), .\const (90)) inst120ggg (.data(inst120ggg_data));
  CMPX #(.size(10)) inst5568 (.A(target1x1), .B(10'b0001010000), .ls(inst5568_ls), .eq(target1xeq0));  // open: gr
  and inst2081 (ValidTarget2, target2xok, target2yok);
  and inst755623135 (inst755623135_out, target1xeq0, decTarget1);
  REGX #(.size(10), .default_value(150)) u_572 (
    .clk(CLK), .ld(ldTarget), .cl(clTarget2), .data_in(inst126_data), .data_out(target2y1));  // open: inc, dec
  CMPX #(.size(10)) inst4326 (.A(Y), .B(target2y1), .gr(inst4326_gr));  // open: ls, eq
  and inst116 (inst116_out, target1xeqmax, incTarget1);
  REGX #(.size(10), .default_value(120)) inst237 (
    .clk(CLK), .ld(ldTarget), .cl(clTarget1), .data_in(inst119das_data), .data_out(target1y2));  // open: inc, dec
  or inst112 (inst112_out, inst755623135_out, inst116_out);
  CONSTX #(.size(10), .\const (150)) inst126 (.data(inst126_data));
  CMPX #(.size(10)) inst5325 (.A(Y), .B(target1y2), .ls(inst5325_ls));  // open: eq, gr
  CMPX #(.size(10)) inst5569 (.A(target2x1), .B(10'b0000010000), .ls(inst5569_ls), .eq(target2xeq0));  // open: gr
  TFF inst111 (.T(inst112_out), .CLK(CLK), .Q(incTarget1));  // open: PRN, CLRN
  and inst755623136 (inst755623136_out, target2xeq0, decTarget2);
  CONSTX #(.size(10), .\const (120)) inst119das (.data(inst119das_data));
  and inst6325 (target1yok, inst5325_ls, inst4325_gr);
  and inst122a (inst122a_out, target2xeqmax, incTarget2);
  CMPX #(.size(10)) inst104 (.A(target1x2), .B(10'b1100001011), .eq(target1xeqmax));  // open: ls, gr
  not inst113 (decTarget1, incTarget1);
  or inst118a (inst118a_out, inst755623136_out, inst122a_out);
  REGX #(.size(10), .default_value(180)) inst238 (
    .clk(CLK), .ld(ldTarget), .cl(clTarget2), .data_in(inst127_data), .data_out(target2y2));  // open: inc, dec
  CMPX #(.size(10)) inst5326 (.A(Y), .B(target2y2), .ls(inst5326_ls));  // open: eq, gr
  TFF inst117 (.T(inst118a_out), .CLK(CLK), .Q(decTarget2));  // open: PRN, CLRN
  CONSTX #(.size(10), .\const (180)) inst127 (.data(inst127_data));
  and inst6326 (target2yok, inst5326_ls, inst4326_gr);
  CMPX #(.size(10)) inst123 (.A(target2x2), .B(10'b1100001011), .eq(target2xeqmax));  // open: ls, gr
  not inst119a (incTarget2, decTarget2);

  // Other names for the same wires on the sheet: decX1 = moveLeft; incX1 = moveRight; jmp = moveJump

  // Notes on the sheet:
  //   RISING_EDGE
  //   RISING_EDGE
endmodule
